# EAGLE schematic temporizador rev1 (EAGLE 8.5.1)
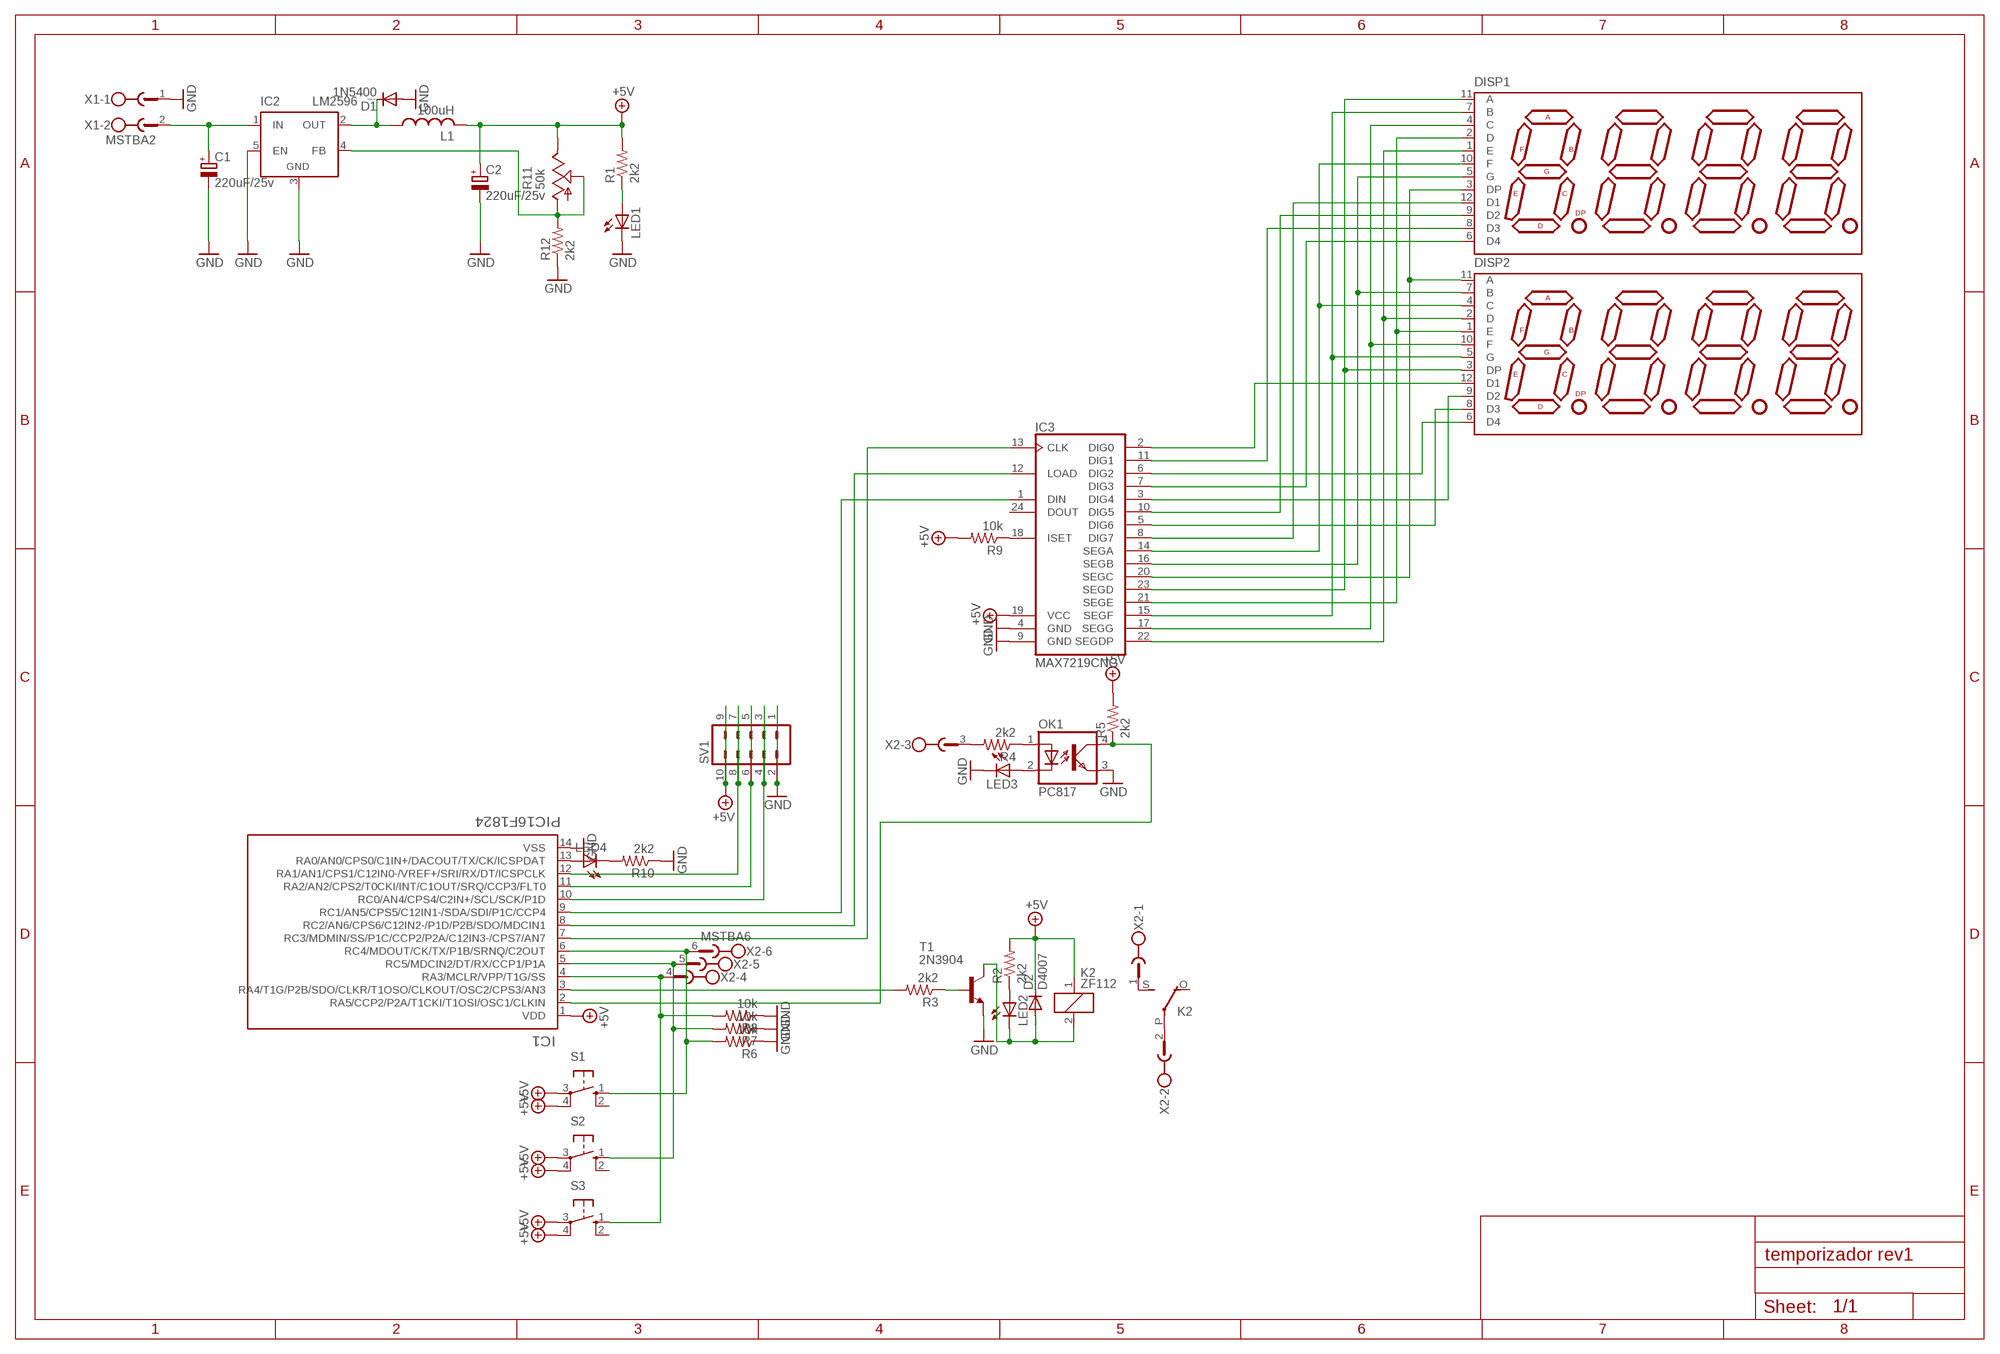
[diagram p0: schematic, sheet 1]

## Parts
C1  220uF/25v  CPOL-EUE3.5-10  [E3,5-10]
C2  220uF/25v  CPOL-EUE3.5-10  [E3,5-10]
D1  1N5400  [DO201-15]
D2  D4007  1N4148DO35-10  [DO35-10]
DISP1  DISP_7SEG_4DIG  [DISP_7SEG_4DIG]
DISP2  DISP_7SEG_4DIG  [DISP_7SEG_4DIG]
IC1  PIC16F1824  [PDIP14_300MC]
IC2  LM2596  LM2596TV  [TO220-51]
IC3  MAX7219CNG  [DIL24-3]
K2  ZF112  [ZF112]
L1  100uH  L-US6000-XXX-RC  [6000-XXXX-RC]
LED1  LED3MM  [LED3MM]
LED2  LED3MM  [LED3MM]
LED3  LED3MM  [LED3MM]
LED4  LED3MM  [LED3MM]
OK1  PC817  [DIL04]
R1  2k2  R-US_0207/10  [0207/10]
R2  2k2  R-US_0207/10  [0207/10]
R3  2k2  R-US_0207/10  [0207/10]
R4  2k2  R-US_0207/10  [0207/10]
R5  2k2  R-US_0207/10  [0207/10]
R6  10k  R-US_0207/10  [0207/10]
R7  10k  R-US_0207/10  [0207/10]
R8  10k  R-US_0207/10  [0207/10]
R9  10k  R-US_R0805  [R0805]
R10  2k2  R-US_0207/10  [0207/10]
R11  50k  TRIM_US-B25P  [B25P]
R12  2k2  R-US_0207/10  [0207/10]
S1  10-XX  [B3F-10XX]
S2  10-XX  [B3F-10XX]
S3  10-XX  [B3F-10XX]
SV1  MA05-2  [MA05-2]
T1  2N3904  2N3904-NPN-TO92-EBC  [TO92-EBC]
X1  MSTBA2  [MSTBA2]
X2  MSTBA6  [MSTBA6]

## Nets
+5V: C2.+ D2.C IC1.1(VDD) IC3.19(VCC) K2.1 L1.2 R1.2 R2.2 R5.2 R9.2 R11.E S1.3(P) S1.4(P1) S2.3(P) S2.4(P1) S3.3(P) S3.4(P1) SV1.9 SV1.10
GND: C1.- C2.- D1.A IC1.14(VSS) IC2.3(GND) IC2.5(EN) IC3.4(GND) IC3.9(GND) LED1.K(C) LED3.K(C) OK1.3(EMIT) R6.1 R7.1 R8.1 R10.1 R12.1 SV1.1 SV1.2 T1.E X1.1
N$1: LED1.A R1.1
N$2: C1.+ IC2.1(IN) X1.2
N$3: D1.C IC2.2(OUT) L1.1
N$4: DISP1.3(DP) DISP2.11(A) IC3.20(SEGC)
N$5: DISP1.2(D) DISP2.1(E) IC3.21(SEGE)
N$6: DISP1.1(E) DISP2.2(D) IC3.22(SEGDP)
N$7: DISP1.4(C) DISP2.10(F) IC3.17(SEGG)
N$8: IC3.18(ISET) R9.1
N$9: DISP1.5(G) DISP2.7(B) IC3.16(SEGB)
N$10: DISP1.11(A) DISP2.3(DP) IC3.23(SEGD)
N$11: DISP1.7(B) DISP2.5(G) IC3.15(SEGF)
N$12: LED2.A R2.1
N$13: R3.1 T1.B
N$14: D2.A K2.2 LED2.K(C) T1.C
N$15: OK1.1(A) R4.1
N$16: LED3.A OK1.2(C)
N$17: IC1.6(RC4/MDOUT/CK/TX/P1B/SRNQ/C2OUT) R6.2 S1.1(S) X2.6
N$18: IC1.3(RA4/T1G/P2B/SDO/CLKR/T1OSO/CLKOUT/OSC2/CPS3/AN3) R3.2
N$19: IC1.2(RA5/CCP2/P2A/T1CKI/T1OSI/OSC1/CLKIN) OK1.4(COL) R5.1
N$20: IC1.5(RC5/MDCIN2/DT/RX/CCP1/P1A) R7.2 S2.1(S) X2.5
N$21: IC1.4(RA3/MCLR/VPP/T1G/SS) R8.2 S3.1(S) X2.4
N$22: DISP1.10(F) DISP2.4(C) IC3.14(SEGA)
N$23: IC1.8(RC2/AN6/CPS6/C12IN2-/P1D/P2B/SDO/MDCIN1) IC3.12(LOAD)
N$24: IC1.9(RC1/AN5/CPS5/C12IN1-/SDA/SDI/P1C/CCP4) IC3.1(DIN)
N$25: IC1.7(RC3/MDMIN/SS/P1C/CCP2/P2A/C12IN3-/CPS7/AN7) IC3.13(CLK)
N$26: K2.S(2:S) X2.1
N$27: K2.P(2:P) X2.2
N$28: R4.2 X2.3
N$29: IC1.13(RA0/AN0/CPS0/C1IN+/DACOUT/TX/CK/ICSPDAT) LED4.A
N$30: LED4.K(C) R10.2
N$31: IC1.12(RA1/AN1/CPS1/C12IN0-/VREF+/SRI/RX/DT/ICSPCLK) SV1.7 SV1.8
N$32: IC1.11(RA2/AN2/CPS2/T0CKI/INT/C1OUT/SRQ/CCP3/FLT0) SV1.5 SV1.6
N$33: IC1.10(RC0/AN4/CPS4/C2IN+/SCL/SCK/P1D) SV1.3 SV1.4
N$34: DISP1.6(D4) IC3.7(DIG3)
N$35: DISP1.12(D1) IC3.8(DIG7)
N$36: DISP1.9(D2) IC3.10(DIG5)
N$37: DISP1.8(D3) IC3.11(DIG1)
N$38: DISP2.6(D4) IC3.6(DIG2)
N$39: DISP2.8(D3) IC3.5(DIG6)
N$40: DISP2.9(D2) IC3.3(DIG4)
N$41: DISP2.12(D1) IC3.2(DIG0)
N$42: IC2.4(FB) R11.A R11.S R12.2
Unconnected: IC3.24(DOUT) K2.O(2:O) S1.2(S1) S2.2(S1) S3.2(S1)

## Library data of the parts
C1 C2 = rcl:CPOL-EU: POLARIZED CAPACITOR, European symbol; SPICEPREFIX: C
D1 = diode:1N5400: DIODE standard rectifier, 3 A, 50 V (Motorola)
D2 = diode:1N4148: DIODE high speed (Philips)
DISP1 DISP2 = makerelectronico:DISP_7SEG_4DIG: Display 7 segment 4 digit code datasheet: FJ5461AH
IC1 = PIC16F1824:PIC16F1824: Características PIC16F1824: Memoria Programa (FLASH): 7 KB. Memoria RAM: 256 Bytes. Memoria EEPROM: 256 Bytes. CPU speed: 32Mhz. Comunicación: UART, I2C, SPI. Salidas PWM: 4 (2 CCP/ 2 ECCP). Temporizador 8Bits: 4. Temporizador 16Bits: 1. Convertidor ADC 10bits: 8. Librerías de EC ELECTRONIC DEVELOPER EIRL Visitar www.MakerElectronico.com para mas información.
IC2 = linear:LM2596T: STEP-DOWN VOLTAGE REGULATOR
IC3 = maxim:MAX7219CNG: LED DISPLAY DRIVER; MF: MAXIM; MPN: MAX7219CNG; OC_FARNELL: 1523914; OC_NEWARK: 34C4018
K2 = relay:ZF112: RELAY 1 x switch; OC_FARNELL: unknown; OC_NEWARK: unknown
L1 = rcl:L-US: INDUCTOR, American symbol; SPICEPREFIX: L
LED1-LED4 = led:LED: LED OSRAM: - CHIPLED LG R971, LG N971, LY N971, LG Q971, LY Q971, LO R971, LY R971 LH N974, LH R974 LS Q976, LO Q976, LY Q976 LO Q996 - Hyper CHIPLED LW Q18S LB Q993, LB Q99A, LB R99A - SideLED LS A670, LO A670, LY A670, LG A670, LP A670 LB A673, LV A673, LT A673, LW A673 LH A674 LY A675 LS A676, LA A676, LO A676, LY A676, LW A676 LS A679, LY A679, LG A679 - Hyper Micro SIDELED® LS Y876, LA Y876, LO Y876, LY Y876 LT Y87S - SmartLED LW L88C, LW L88S LB L89C, LB L89S, LG L890 LS L89K, LO L89K, LY L89K LS L896, LA L896, LO L896, LY L896 - TOPLED LS T670, LO T670, LY T670, LG T670, LP T670 LSG T670, LSP T670, LSY T670, LOP T670, LYG T670 LG T671, LOG T671, LSG T671 LB T673, LV T673, LT T673, LW T673 LH T674 LS T676, LA T676, LO T676, LY T676, LB T676, LH T676, LSB T676, LW T676 LB T67C, LV T67C, LT T67C, LS T67K, LO T67K, LY T67K, LW E67C LS E67B, LA E67B, LO E67B, LY E67B, LB E67C, LV E67C, LT E67C LW T67C LS T679, LY T679, LG T679 LS T770, LO T770, LY T770, LG T770, LP T770 LB T773, LV T773, LT T773, LW T773 LH T774 LS E675, LA E675, LY E675, LS T675 LS T776, LA T776, LO T776, LY T776, LB T776 LHGB T686 LT T68C, LB T68C - Hyper Mini TOPLED® LB M676 - Mini TOPLED Santana® LG M470 LS M47K, LO M47K, LY M47K Source: http://www.osram.convergy.de LUXEON: - LUMILED® LXK2-PW12-R00, LXK2-PW12-S00, LXK2-PW14-U00, LXK2-PW14-V00 LXK2-PM12-R00, LXK2-PM12-S00, LXK2-PM14-U00 LXK2-PE12-Q00, LXK2-PE12-R00, LXK2-PE12-S00, LXK2-PE14-T00, LXK2-PE14-U00 LXK2-PB12-K00, LXK2-PB12-L00, LXK2-PB12-M00, LXK2-PB14-N00, LXK2-PB14-P00, LXK2-PB14-Q00 LXK2-PR12-L00, LXK2-PR12-M00, LXK2-PR14-Q00, LXK2-PR14-R00 LXK2-PD12-Q00, LXK2-PD12-R00, LXK2-PD12-S00 LXK2-PH12-R00, LXK2-PH12-S00 LXK2-PL12-P00, LXK2-PL12-Q00, LXK2-PL12-R00 Source: www.luxeon.com KINGBRIGHT: KA-3528ASYC Source: www.kingbright.com
OK1 = optocoupler:PC817: SHARP OPTO COUPLER; MPN: PC817X4J000F; OC_FARNELL: 9707727; OC_NEWARK: 97K7059
R1-R10 R12 = rcl:R-US_: RESISTOR, American symbol; SPICEPREFIX: R
R11 = pot:TRIM_US-: POTENTIOMETER
S1-S3 = switch-omron:10-XX: OMRON SWITCH; MPN: B3F-1000; OC_FARNELL: 176432; OC_NEWARK: 36M3542
SV1 = con-lstb:MA05-2: PIN HEADER; OC_FARNELL: unknown; OC_NEWARK: unknown
T1 = transistor-neu-to92:*-NPN-: NPN Transistror
X1 = con-phoenix-508:MSTBA2: PHOENIX; MF: FARNELL; MPN: 1757242; OC_FARNELL: 3705171; OC_NEWARK: 71C4161
X2 = con-phoenix-508:MSTBA6: PHOENIX; MF: FARNELL; MPN: 1757284; OC_FARNELL: 3705213; OC_NEWARK: 71C4165